# Altium project Mirror TurnSignal - v 2.0.PrjPcb
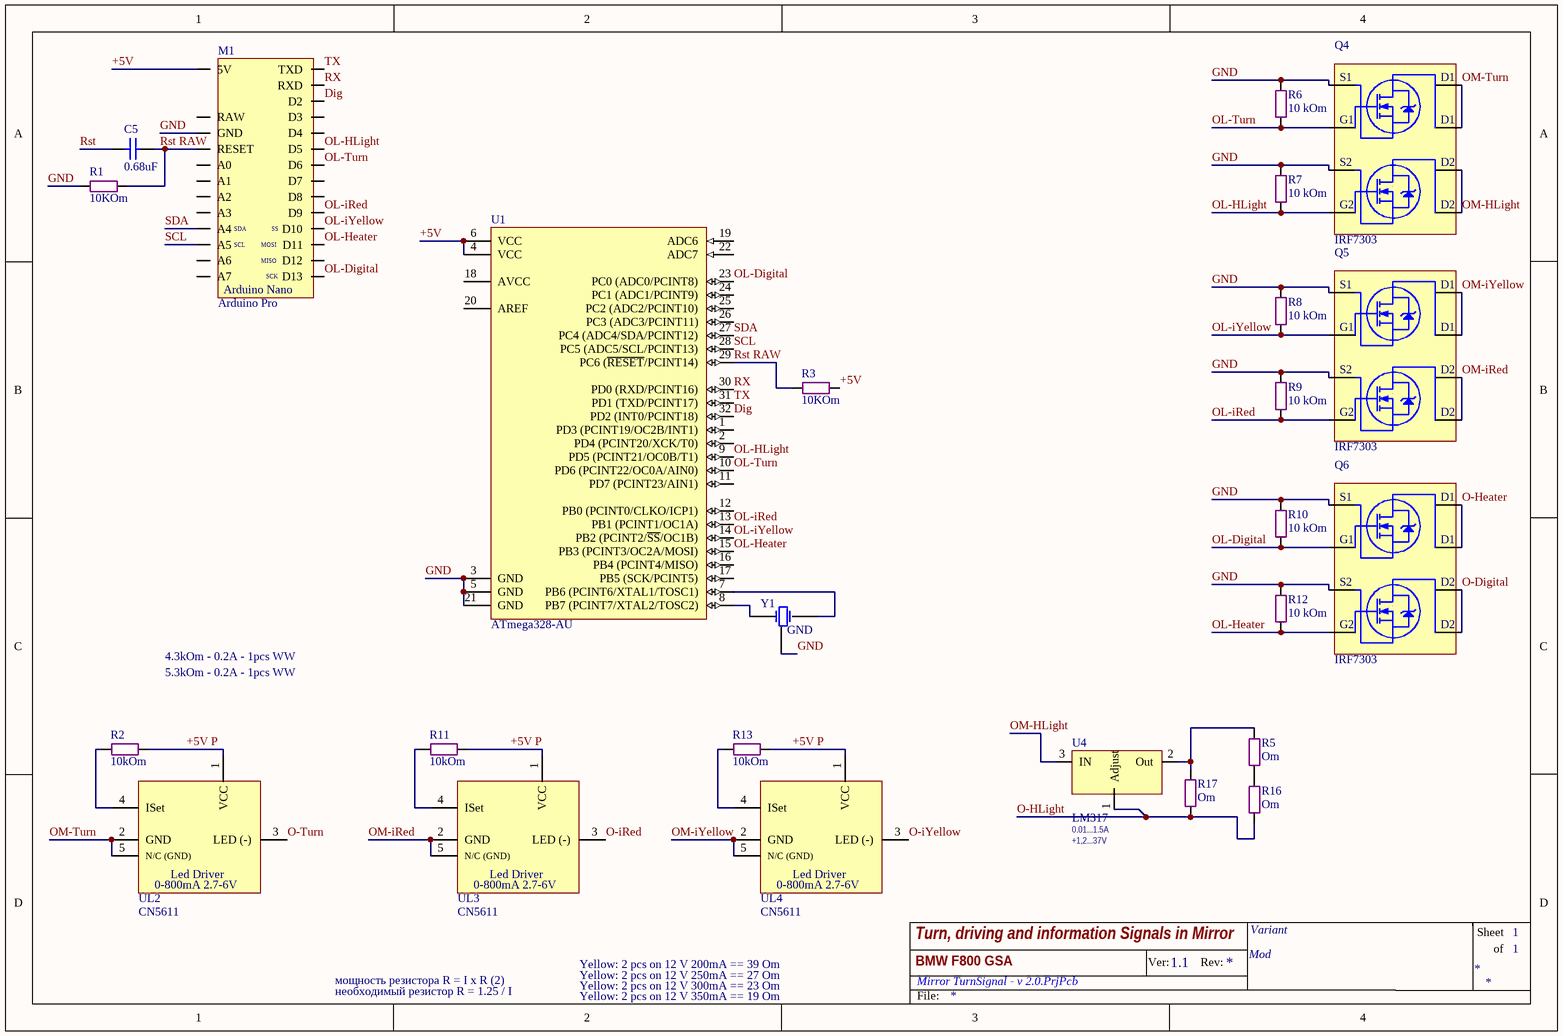
[diagram p0: Mirror TurnSignal.SchDoc]
2 sheets, 62 parts. Net scope: global (net labels, ports and power ports of the same name join across sheets).
Board file: Mirror TurnSignal.PcbDoc
Sheets:
  Mirror TurnSignal.SchDoc
  Mirror TurnSignal - Connectors and Power supply.SchDoc

## Sheet Mirror TurnSignal.SchDoc: Turn, driving and information Signals in Mirror
size A4; SheetNumber: 1; SheetTotal: 1; Version: 1.1; Variant: Variant; Modification: Mod; Project: BMW F800 GSA

### Parts
C5  0.68uF  [SMD 0805 (2012)]
M1  Arduino Pro  [Arduino Pro Mini Low (no A0-3,6-7,D3)]
Q4  IRF7303  [SO8]
Q5  IRF7303  [SO8]
Q6  IRF7303  [SO8]
R1  10KOm  [SMD 0805 (2012)]
R2  10kOm  [SMD 0805 (2012)]
R3  10KOm  [SMD 0805 (2012)]
R5  Om  [Res 5W L22mm, p22.86]
R6  10 kOm  [SMD 0805 (2012)]
R7  10 kOm  [SMD 0805 (2012)]
R8  10 kOm  [SMD 0805 (2012)]
R9  10 kOm  [SMD 0805 (2012)]
R10  10 kOm  [SMD 0805 (2012)]
R11  10kOm  [SMD 0805 (2012)]
R12  10 kOm  [SMD 0805 (2012)]
R13  10kOm  [SMD 0805 (2012)]
R16  Om  [Res 5W L22mm, p22.86]
R17  Om  [Res 10W L48mm, p49mm]
U1  ATmega328-AU  [32A_M]
U4  LM317  I output (A) Adjustable: 0.01...1.5A  V Out: +1,2...37V  [TO220 L]
UL2  CN5611  [SOT-89-5]
UL3  CN5611  [SOT-89-5]
UL4  CN5611  [SOT-89-5]
Y1  16MHz  [XTAL - 3.2x1.2 SMD ws GND]  (value not drawn)

### Nets
GND: M1.GND Q4.1(S) Q4.3(S) Q5.1(S) Q5.3(S) Q6.1(S) Q6.3(S) R1.1 R6.2 R7.2 R8.2 R9.2 R10.2 R12.2 U1.3(GND) U1.5(GND) U1.21(GND) Y1.3(GND)
+5V: M1.5V R3.2 U1.4(VCC) U1.6(VCC)
+5V P: R2.1 R11.1 R13.1 UL2.1(VCC) UL3.1(VCC) UL4.1(VCC)
Dig: M1.D2 U1.32(PD2_(INT0/PCINT18))
O-Digital: Q6.5(D) Q6.6(D)
O-Heater: Q6.7(D) Q6.8(D)
O-HLight: R16.1 R17.1 U4.1(Adjust)
O-iRed: UL3.3(LED_(-))
O-iYellow: UL4.3(LED_(-))
O-Turn: UL2.3(LED_(-))
OL-Digital: M1.D13 Q6.2(G) R10.1 U1.23(PC0_(ADC0/PCINT8))
OL-Heater: M1.D11 Q6.4(G) R12.1 U1.15(PB3_(PCINT3/OC2A/MOSI))
OL-HLight: M1.D5 Q4.4(G) R7.1 U1.9(PD5_(PCINT21/OC0B/T1))
OL-iRed: M1.D9 Q5.4(G) R9.1 U1.13(PB1_(PCINT1/OC1A))
OL-iYellow: M1.D10 Q5.2(G) R8.1 U1.14(PB2_(PCINT2/~{SS}/OC1B))
OL-Turn: M1.D6 Q4.2(G) R6.1 U1.10(PD6_(PCINT22/OC0A/AIN0))
OM-HLight: Q4.5(D) Q4.6(D) U4.3(IN)
OM-iRed: Q5.5(D) Q5.6(D) UL3.2(GND) UL3.5(N/C_(GND))
OM-iYellow: Q5.7(D) Q5.8(D) UL4.2(GND) UL4.5(N/C_(GND))
OM-Turn: Q4.7(D) Q4.8(D) UL2.2(GND) UL2.5(N/C_(GND))
Rst: C5.1
Rst RAW: C5.2 M1.RESET R1.2 R3.1 U1.29(PC6_(~{RESET}/PCINT14))
RX: M1.RXD U1.30(PD0_(RXD/PCINT16))
SCL: M1.A5 U1.28(PC5_(ADC5/SCL/PCINT13))
SDA: M1.A4 U1.27(PC4_(ADC4/SDA/PCINT12))
TX: M1.TXD U1.31(PD1_(TXD/PCINT17))
NetR2_2: R2.2 UL2.4(ISet)
NetR5_1: R5.1 R16.2
NetR5_2: R5.2 R17.2 U4.2(Out)
NetR11_2: R11.2 UL3.4(ISet)
NetR13_2: R13.2 UL4.4(ISet)
NetU1_7: U1.7(PB6_(PCINT6/XTAL1/TOSC1)) Y1.2(OSC2)
NetU1_8: U1.8(PB7_(PCINT7/XTAL2/TOSC2)) Y1.1(OSC1)

Not connected (* = marked no-connect by the designer): M1 A0 A1 A2 A3 A6 A7 D3 D4 D7 D8 D12 RAW; U1 1(PD3_(PCINT19/OC2B/INT1)) 2(PD4_(PCINT20/XCK/T0)) 11(PD7_(PCINT23/AIN1)) 12(PB0_(PCINT0/CLKO/ICP1)) 16(PB4_(PCINT4/MISO)) 17(PB5_(SCK/PCINT5)) 18(AVCC) 19(ADC6) 20(AREF) 22(ADC7) 24(PC1_(ADC1/PCINT9)) 25(PC2_(ADC2/PCINT10)) 26(PC3_(ADC3/PCINT11))

### Notes on the sheet
- 4.3kOm - 0.2A - 1pcs WW
- 5.3kOm - 0.2A - 1pcs WW
- мощность резистора R = I x R (2)
- Yellow: 2 pcs on 12 V 300mA == 23 Om
- Yellow: 2 pcs on 12 V 200mA == 39 Om
- Yellow: 2 pcs on 12 V 250mA == 27 Om
- необходимый резистор R = 1.25 / I
- Yellow: 2 pcs on 12 V 350mA == 19 Om
- Ver:
- Rev:
- Sheet
- of
- File:
- (in symbol Arduino Pro Micro) SDA; SS; SCL; MOSI; MISO; SCK; Arduino Nano
- (in symbol CN5611) Led Driver; 0-800mA 2.7-6V
- (in symbol IRF7303) S1; D1; G1; S2; D2; G2

### Library data of the parts
C5 = Cap SMD 0402-1812: Capacitor
M1 = Arduino Pro Micro
Q4-Q6 = IRF7303: Dual N-Ch  30V - 0.05Ω - 4.9A; Manufacturer: Farchild; RDS: <0.05Om; I d - Drain current (continuous) at TC = 70°C: 3.9 A; C In: 520pF; C Out: 180pF; V DSS (v): 30 v; I d - Drain current (continuous) at TC = 25°C: 4.9 A; Name: IRF7303; Datasheet: http://tec.org.ru/board/0-0-0-3164-20
R1-R3 R6-R13 = Res All Types
R5 R16 = Res 5W: 5W Cement
R17 = Res 10W: 10W Cement
U1 = ATmega328-AU: 8-bit AVR Microcontroller, 32KB Flash, 1KB EEPROM, 2KB SRAM, 32-pin TQFP, Industrial Grade (-40°C to 85°C); Published: 1-Apr-2010; DatasheetVersion: revA, Jan-2010; PackageVersion: revB, Oct-2001; PackageReference: 32A; Publisher: Altium Limited; PackageDescription: 32-Lead, 7x7x1.0 mm Body, 0.8mm Lead Pitch, Thin Profile Plastic Quad Flat Package (TQFP); Supplier 1: Digi-Key; Supplier Part Number 1: ATMEGA328-AU-ND; Supplier 2: Mouser; Supplier Part Number 2: 556-ATMEGA328-AU; Code_JEDEC: MS-026-ABA; ComponentLink1Description: Manufacturer Link; ComponentLink1URL: http://www.atmel.com/products/avr/default.asp?; ComponentLink2Description: ATmega48A/48PA/88A/88PA/168A/168PA/328/328P Datasheet; ComponentLink2URL: http://www.atmel.com/dyn/resources/prod_documents/8271.pdf; ComponentLink3Description: ATmega48A/48PA/88A/88PA/168A/168PA/328/328P Summary; ComponentLink3URL: http://www.atmel.com/dyn/resources/prod_documents/8271S.pdf; ComponentLink4Description: Atmel.com Home; ComponentLink4URL: http://www.atmel.com
U4 = LM-317: Voltage Regulator; Напряжение выход-вход (dropout): 2 v; Case: TO-220; Datasheet: http://www.ti.com/lit/ds/symlink/lm317.pdf
UL2-UL4 = CN5611: Led Driver 0-800mA 2.7-6V; PackageDescription: SOT-89; ComponentLink2Description: Datasheet; Name: CN5611
Y1 = XTAL ws CAP: 3 Pin with Capacitors; PackageDescription: Crystal, SMD; 3 Pads; Body 3.2 x 1.2 x 1 mm; CSTCE16M0V53-R0 DatySheet: http://www.murata.com/~/media/webrenewal/support/library/catalog/products/timingdevice/ceralock/p17e.ashx

## Sheet Mirror TurnSignal - Connectors and Power supply.SchDoc
size A4
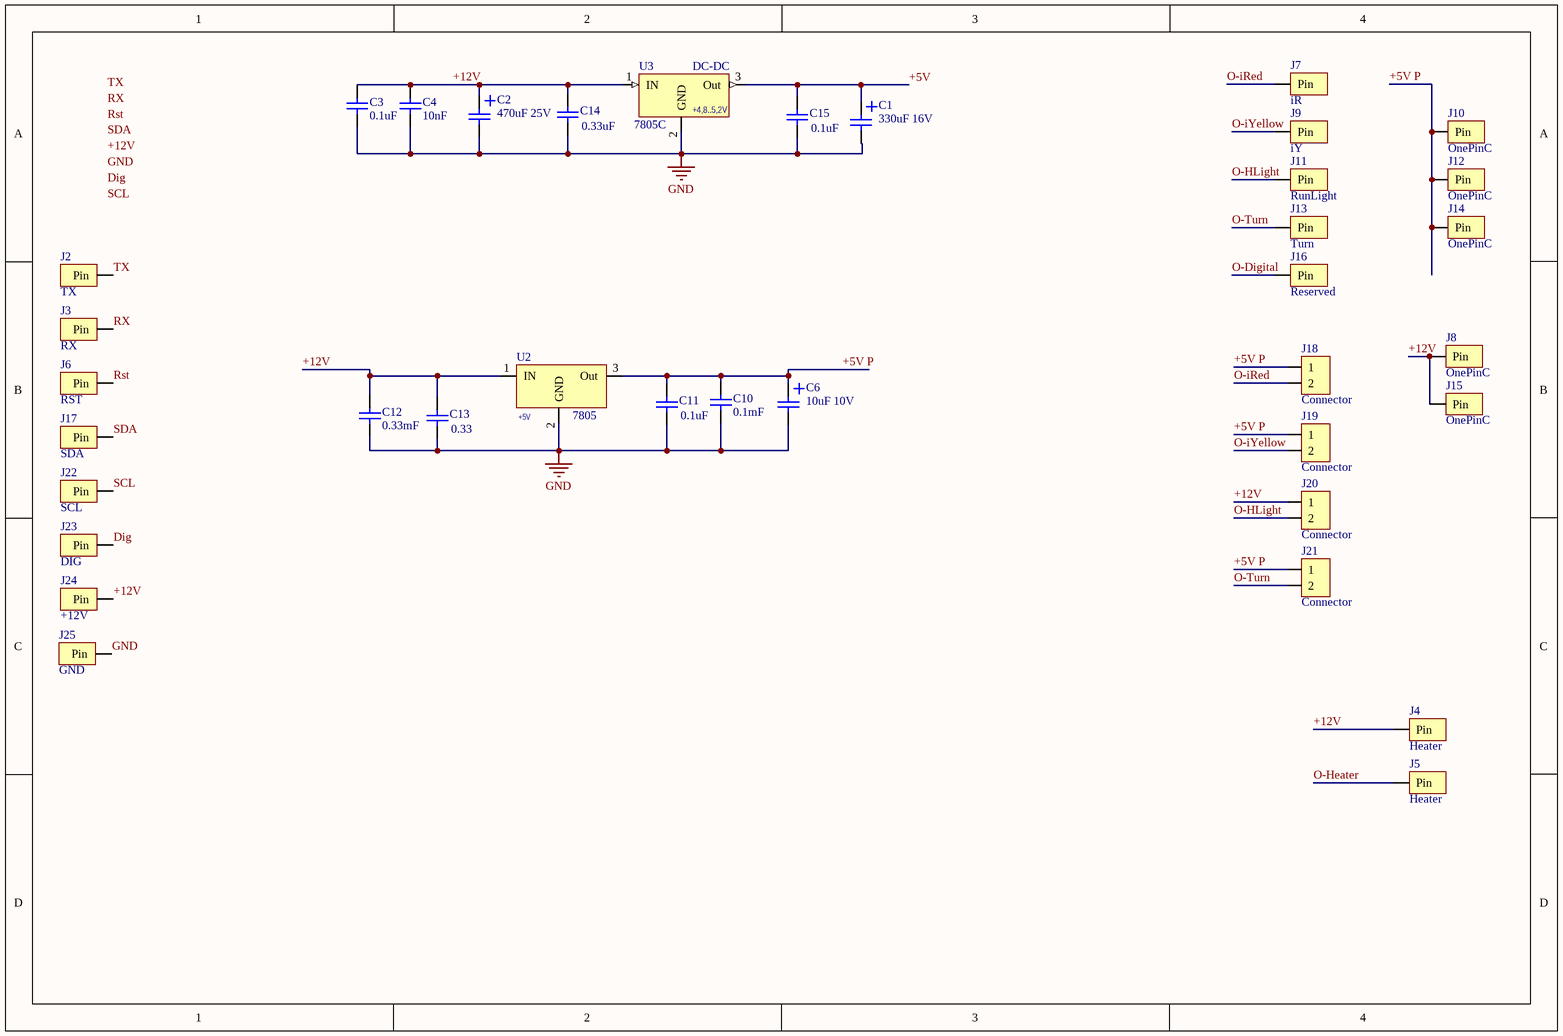
[diagram p1: Mirror TurnSignal - Connectors and Power supply.SchDoc]

### Parts
C1  330uF 16V  [Cap E p3.5mm D8xH12 R - PR]
C2  470uF 25V  [Cap E p2.54mm D4xH8 (2p)]
C3  0.1uF  [SMD 0805 (2012)]
C4  10nF  [SMD 0805 (2012)]
C6  10uF 10V  [Cap E p1.5mm D4xH8 (2p)]
C10  0.1mF  [Cap p2.54mm (2p)]
C11  0.1uF  [SMD 1206 (3216)]
C12  0.33mF  [Cap p2.54mm (2p)]
C13  0.33  [SMD 1206 (3216)]
C14  0.33uF  [SMD 1206 (3216)]
C15  0.1uF  [SMD 1206 (3216)]
J2  TX  [OnePin 0.7x2]
J3  RX  [OnePin 0.7x2]
J4  Heater  [OnePin 3x10mm Hole 0.7x8]
J5  Heater  [OnePin 3x10mm Hole 0.7x8]
J6  RST  [OnePin 0.7x2]
J7  iR  [OnePin 1.2x3]
J8  OnePinC  [OnePin 1.2x3]
J9  iY  [OnePin 1.2x3]
J10  OnePinC  [OnePin 1.2x3]
J11  RunLight  [OnePin 1.2x3]
J12  OnePinC  [OnePin 1.2x3]
J13  Turn  [OnePin 1.2x3]
J14  OnePinC  [OnePin 1.2x3]
J15  OnePinC  [OnePin 1.2x3]
J16  Reserved  [OnePin 1.2x3]
J17  SDA  [OnePin 0.7x2]
J18  Connector  [CWF-2]
J19  Connector  [CWF-2]
J20  Connector  [CWF-2]
J21  Connector  [CWF-2]
J22  SCL  [OnePin 0.7x2]
J23  DIG  [OnePin 0.7x2]
J24  +12V  [OnePin 0.7x2]
J25  GND  [OnePin 0.7x2]
U2  7805  V Out: +5V  [TO220 L]
U3  7805C  V Out: +4,8..5,2V  [D-PAK]

### Nets
GND: C1.2 C2.2 C3.2 C4.2 C6.2 C10.2 C11.2 C12.2 C13.2 C14.2 C15.2 J25.1(Pin) U2.2(GND) U3.2(GND)
+5V: C1.1 C15.1 U3.3(Out)
+5V P: C6.1 C10.1 C11.1 J10.1(Pin) J12.1(Pin) J14.1(Pin) J18.1 J19.1 J21.1 U2.3(Out)
+12V: C2.1 C3.1 C4.1 C12.1 C13.1 C14.1 J4.1(Pin) J8.1(Pin) J15.1(Pin) J20.1 J24.1(Pin) U2.1(IN) U3.1(IN)
Dig: J23.1(Pin)
O-Digital: J16.1(Pin)
O-Heater: J5.1(Pin)
O-HLight: J11.1(Pin) J20.2
O-iRed: J7.1(Pin) J18.2
O-iYellow: J9.1(Pin) J19.2
O-Turn: J13.1(Pin) J21.2
Rst: J6.1(Pin)
RX: J3.1(Pin)
SCL: J22.1(Pin)
SDA: J17.1(Pin)
TX: J2.1(Pin)

### Notes on the sheet
- (near U3) DC-DC
- Labels drawn without touching a wire or pin: +12V, Dig, GND, Rst, RX, SCL, SDA, TX

### Library data of the parts
C1 C2 C6 = Cap Elecrolitic: Capacitor
C3 C4 C11 C13-C15 = Cap SMD 0402-1812: Capacitor
C10 C12 = Cap Ceramic: Capacitor
J2-J17 J22-J25 = OnePin Connector: Only pad
J18-J21 = CWF-2 (R): CWF series
U2 = KPEH: Linear Voltage Regulator; t: 0...+150°C; Case: TO220; Name: Linear Voltage Regulator
U3 = 7805C: Voltage Regulator; Manufacturer: Интеграл; I output (A): 1; Max Voltage In (V): 35; Напряжение выход-вход (dropout): >2V; t: -10..+70°C; Case: D2PAK; Shema: http://tec.org.ru/_bd/5/57349922.jpg; Name: 7805C

## Nets that join several sheets
GND: Mirror TurnSignal (18 pins), Mirror TurnSignal - Connectors and Power supply (14 pins)
+5V: Mirror TurnSignal (M1.5V R3.2 U1.4 U1.6), Mirror TurnSignal - Connectors and Power supply (C1.1 C15.1 U3.3)
+5V P: Mirror TurnSignal (6 pins), Mirror TurnSignal - Connectors and Power supply (10 pins)
Dig: Mirror TurnSignal (M1.D2 U1.32), Mirror TurnSignal - Connectors and Power supply (J23.1)
O-Digital: Mirror TurnSignal (Q6.5 Q6.6), Mirror TurnSignal - Connectors and Power supply (J16.1)
O-Heater: Mirror TurnSignal (Q6.7 Q6.8), Mirror TurnSignal - Connectors and Power supply (J5.1)
O-HLight: Mirror TurnSignal (R16.1 R17.1 U4.1), Mirror TurnSignal - Connectors and Power supply (J11.1 J20.2)
O-iRed: Mirror TurnSignal (UL3.3), Mirror TurnSignal - Connectors and Power supply (J7.1 J18.2)
O-iYellow: Mirror TurnSignal (UL4.3), Mirror TurnSignal - Connectors and Power supply (J9.1 J19.2)
O-Turn: Mirror TurnSignal (UL2.3), Mirror TurnSignal - Connectors and Power supply (J13.1 J21.2)
Rst: Mirror TurnSignal (C5.1), Mirror TurnSignal - Connectors and Power supply (J6.1)
RX: Mirror TurnSignal (M1.RXD U1.30), Mirror TurnSignal - Connectors and Power supply (J3.1)
SCL: Mirror TurnSignal (M1.A5 U1.28), Mirror TurnSignal - Connectors and Power supply (J22.1)
SDA: Mirror TurnSignal (M1.A4 U1.27), Mirror TurnSignal - Connectors and Power supply (J17.1)
TX: Mirror TurnSignal (M1.TXD U1.31), Mirror TurnSignal - Connectors and Power supply (J2.1)